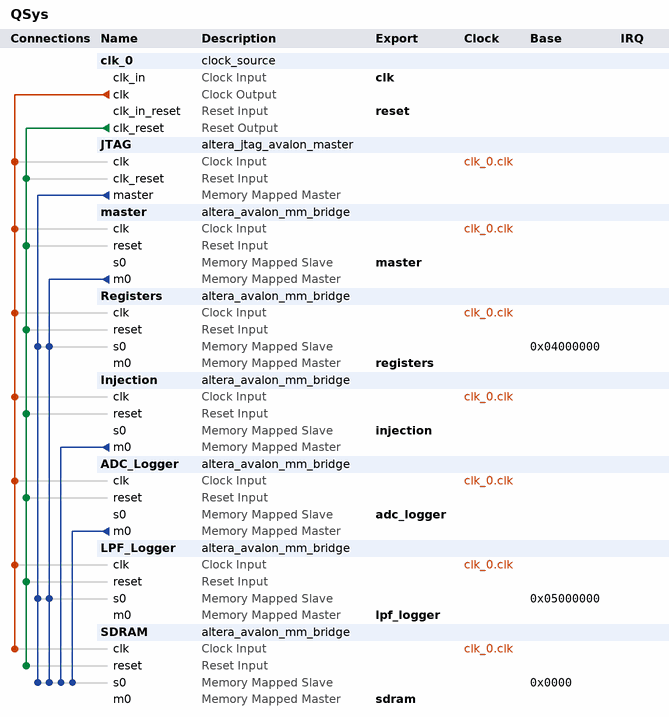
[diagram p0: system contents]
# Platform Designer (Qsys) system QSys, MAX 10 10M50DAF484C7G
# Parameters at their usual value, and those the tool derives, are not listed.
package require -exact qsys 25.1
create_system QSys
set_project_property DEVICE_FAMILY {MAX 10}
set_project_property DEVICE 10M50DAF484C7G

add_instance clk_0 clock_source 25.1
set_instance_parameter_value clk_0 clockFrequency 100000000

add_instance JTAG altera_jtag_avalon_master 25.1

add_instance master altera_avalon_mm_bridge 25.1
set_instance_parameter_value master ADDRESS_UNITS WORDS
set_instance_parameter_value master ADDRESS_WIDTH 30
set_instance_parameter_value master DATA_WIDTH 32
set_instance_parameter_value master MAX_PENDING_RESPONSES 4
set_instance_parameter_value master USE_AUTO_ADDRESS_WIDTH 0

add_instance Registers altera_avalon_mm_bridge 25.1
set_instance_parameter_value Registers ADDRESS_UNITS WORDS
set_instance_parameter_value Registers ADDRESS_WIDTH 8
set_instance_parameter_value Registers DATA_WIDTH 32
set_instance_parameter_value Registers MAX_PENDING_RESPONSES 4
set_instance_parameter_value Registers USE_AUTO_ADDRESS_WIDTH 0

add_instance Injection altera_avalon_mm_bridge 25.1
set_instance_parameter_value Injection ADDRESS_UNITS WORDS
set_instance_parameter_value Injection ADDRESS_WIDTH 25
set_instance_parameter_value Injection DATA_WIDTH 16
set_instance_parameter_value Injection MAX_PENDING_RESPONSES 4
set_instance_parameter_value Injection USE_AUTO_ADDRESS_WIDTH 0

add_instance ADC_Logger altera_avalon_mm_bridge 25.1
set_instance_parameter_value ADC_Logger ADDRESS_UNITS WORDS
set_instance_parameter_value ADC_Logger ADDRESS_WIDTH 24
set_instance_parameter_value ADC_Logger DATA_WIDTH 32
set_instance_parameter_value ADC_Logger MAX_PENDING_RESPONSES 4
set_instance_parameter_value ADC_Logger USE_AUTO_ADDRESS_WIDTH 0

add_instance LPF_Logger altera_avalon_mm_bridge 25.1
set_instance_parameter_value LPF_Logger ADDRESS_UNITS WORDS
set_instance_parameter_value LPF_Logger ADDRESS_WIDTH 10
set_instance_parameter_value LPF_Logger DATA_WIDTH 32
set_instance_parameter_value LPF_Logger MAX_PENDING_RESPONSES 4
set_instance_parameter_value LPF_Logger USE_AUTO_ADDRESS_WIDTH 0

add_instance SDRAM altera_avalon_mm_bridge 25.1
set_instance_parameter_value SDRAM ADDRESS_UNITS WORDS
set_instance_parameter_value SDRAM ADDRESS_WIDTH 25
set_instance_parameter_value SDRAM DATA_WIDTH 16
set_instance_parameter_value SDRAM MAX_PENDING_RESPONSES 4
set_instance_parameter_value SDRAM USE_AUTO_ADDRESS_WIDTH 0

# connections
add_connection clk_0.clk ADC_Logger.clk clock
add_connection clk_0.clk Injection.clk clock
add_connection clk_0.clk JTAG.clk clock
add_connection clk_0.clk LPF_Logger.clk clock
add_connection clk_0.clk master.clk clock
add_connection clk_0.clk Registers.clk clock
add_connection clk_0.clk SDRAM.clk clock
add_connection clk_0.clk_reset ADC_Logger.reset reset
add_connection clk_0.clk_reset Injection.reset reset
add_connection clk_0.clk_reset JTAG.clk_reset reset
add_connection clk_0.clk_reset LPF_Logger.reset reset
add_connection clk_0.clk_reset master.reset reset
add_connection clk_0.clk_reset Registers.reset reset
add_connection clk_0.clk_reset SDRAM.reset reset
add_connection ADC_Logger.m0 SDRAM.s0 avalon
set_connection_parameter_value ADC_Logger.m0/SDRAM.s0 baseAddress 0x0000
add_connection Injection.m0 SDRAM.s0 avalon
set_connection_parameter_value Injection.m0/SDRAM.s0 baseAddress 0x0000
add_connection JTAG.master LPF_Logger.s0 avalon
set_connection_parameter_value JTAG.master/LPF_Logger.s0 baseAddress 0x05000000
add_connection JTAG.master Registers.s0 avalon
set_connection_parameter_value JTAG.master/Registers.s0 baseAddress 0x04000000
add_connection JTAG.master SDRAM.s0 avalon
set_connection_parameter_value JTAG.master/SDRAM.s0 baseAddress 0x0000
add_connection master.m0 LPF_Logger.s0 avalon
set_connection_parameter_value master.m0/LPF_Logger.s0 baseAddress 0x05000000
add_connection master.m0 Registers.s0 avalon
set_connection_parameter_value master.m0/Registers.s0 baseAddress 0x04000000
add_connection master.m0 SDRAM.s0 avalon
set_connection_parameter_value master.m0/SDRAM.s0 baseAddress 0x0000

# exported interfaces
add_interface adc_logger avalon slave
set_interface_property adc_logger EXPORT_OF ADC_Logger.s0
add_interface clk clock sink
set_interface_property clk EXPORT_OF clk_0.clk_in
add_interface injection avalon slave
set_interface_property injection EXPORT_OF Injection.s0
add_interface lpf_logger avalon master
set_interface_property lpf_logger EXPORT_OF LPF_Logger.m0
add_interface master avalon slave
set_interface_property master EXPORT_OF master.s0
add_interface registers avalon master
set_interface_property registers EXPORT_OF Registers.m0
add_interface reset reset sink
set_interface_property reset EXPORT_OF clk_0.clk_in_reset
add_interface sdram avalon master
set_interface_property sdram EXPORT_OF SDRAM.m0

set_interconnect_requirement {$system} qsys_mm.clockCrossingAdapter HANDSHAKE
set_interconnect_requirement {$system} qsys_mm.enableEccProtection FALSE
set_interconnect_requirement {$system} qsys_mm.insertDefaultSlave FALSE
set_interconnect_requirement {$system} qsys_mm.maxAdditionalLatency 1

save_system QSys.qsys
